# EAGLE schematic greenscreamer (EAGLE 8.5.1)
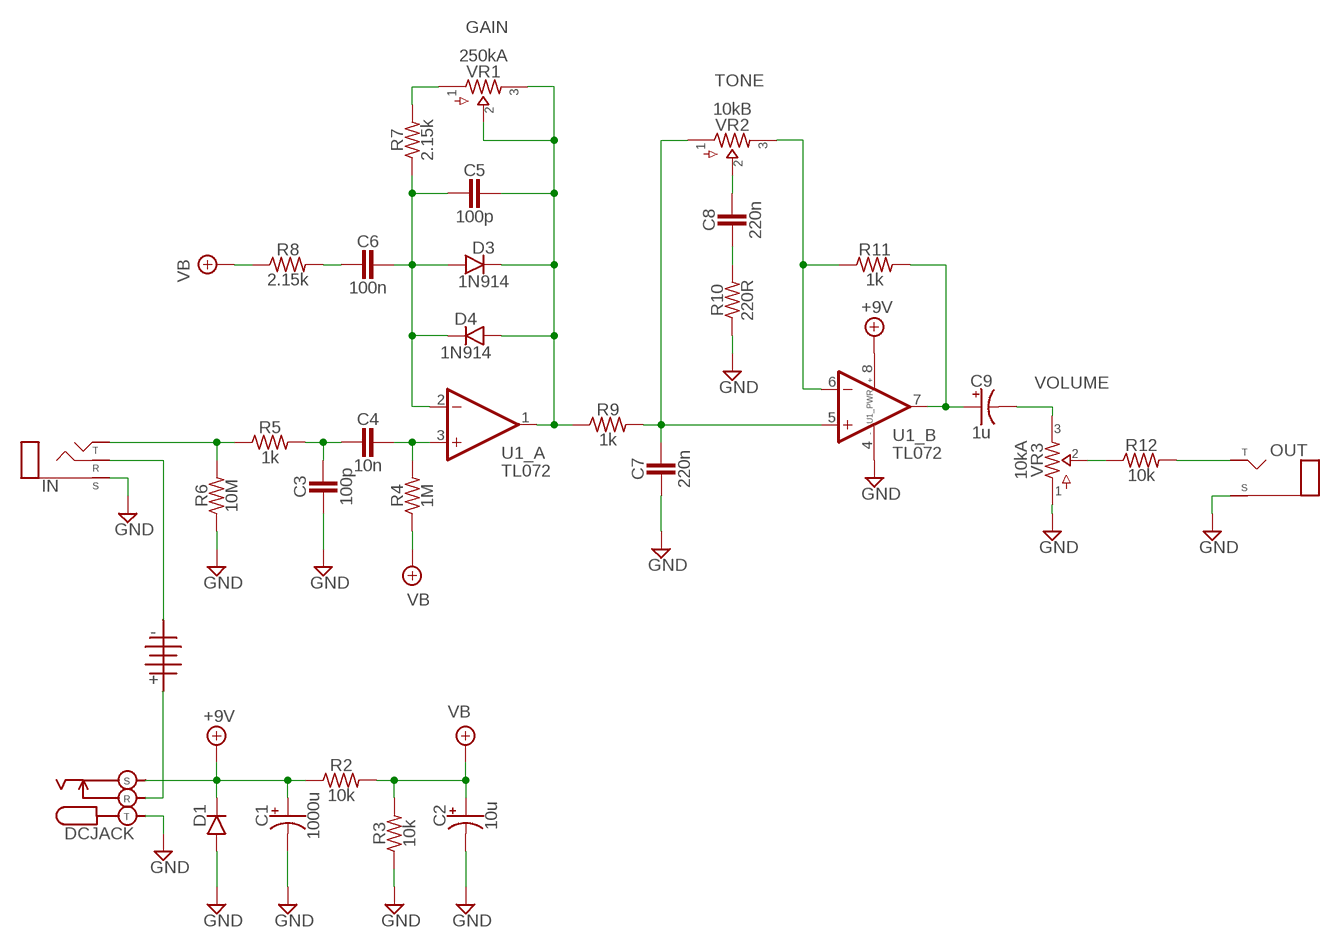
[diagram p0: schematic, sheet 1]

## Parts
1101  BATTERY  [TWO_PADS]
C1  1000u  0500  [050_020]
C2  10u  0500  [050_020]
C3  100p  CER/FILMBOX.1  [BOX_SMALL]
C4  10n  CER/FILMBOX.1  [BOX_SMALL]
C5  100p  CER/FILMBOX.1  [BOX_SMALL]
C6  100n  CER/FILMBOX.1  [BOX_SMALL]
C7  220n  CER/FILMBOX.1  [BOX_SMALL]
C8  220n  CER/FILMBOX.1  [BOX_SMALL]
C9  1u  0500  [050_020]
D1  DO35.2  [DO35-2]
D3  1N914  DO35.2  [DO35-2]
D4  1N914  DO35.2  [DO35-2]
DCJACK  DCJACK  DC_KOBICONN  [DC_KOBICONN]
IN  STEREO3PADS  [THREEPADS]
OUT  MONO  [TWO_PADS]
R2  10k  R_.3B  [R0207/3]
R3  10k  R_.3B  [R0207/3]
R4  1M  R_.3B  [R0207/3]
R5  1k  R_.3B  [R0207/3]
R6  10M  R_.3B  [R0207/3]
R7  2.15k  R_.3B  [R0207/3]
R8  2.15k  R_.3B  [R0207/3]
R9  1k  R_.3B  [R0207/3]
R10  220R  R_.3B  [R0207/3]
R11  1k  R_.3B  [R0207/3]
R12  10k  R_.3B  [R0207/3]
U1  TL072  DUALTH  [DIL0]
VR1  250kA  POTS16MM  [16MM]
VR2  10kB  POTS16MM  [16MM]
VR3  10kA  POTS16MM  [16MM]

## Nets
+9V: C1.+ D1.C DCJACK.S R2.1 U1.8(_PWR:V+)
GND: C1.- C2.- C3.2 C7.2 D1.A DCJACK.T IN.SLEEVE(S) OUT.S(SLEEVE) R3.1 R6.1 R10.1 U1.4(_PWR:V-) VR3.1
N$1: IN.TIP(T) R5.1 R6.2
N$2: 1101.S IN.RING(R)
N$3: C3.1 C4.2 R5.2
N$4: C9.- VR3.3
N$5: C4.1 R4.2 U1.3(_A:+IN)
N$6: C5.2 C6.1 D3.A D4.C R7.1 U1.2(_A:-IN)
N$7: R7.2 VR1.1
N$8: C5.1 D3.C D4.A R9.1 U1.1(_A:OUT) VR1.2 VR1.3
N$9: C6.2 R8.2
N$10: C7.1 R9.2 U1.5(_B:+IN) VR2.1
N$11: R11.1 U1.6(_B:-IN) VR2.3
N$12: C9.+ R11.2 U1.7(_B:OUT)
N$14: C8.1 VR2.2
N$15: C8.2 R10.2
N$16: R12.1 VR3.2
N$17: OUT.T(TIP) R12.2
N$28: 1101.T DCJACK.R
VB: C2.+ R2.2 R3.2 R4.1 R8.1

## Notes on the sheet
- GAIN
- TONE
- VOLUME

## Library data of the parts
1101 = pedals-jacks:BATTERY
C1 C2 C9 = pedals-capacitors-elec:050
C3-C8 = pedals-capacitors-film:CER/FILM: 47 - 120pF Xicon Ceramic Disc 2.5mm lead spacing
D1 D3 D4 = pedals-diodes:DO35: DO-35 Package Diodes: 1N914
DCJACK = pedals-jacks:DC_KOBICONN
IN = pedals-jacks:STEREO
OUT = pedals-jacks:MONO: Mono 1/4" Phone Jack
R2-R12 = pedals-resistors:R_
U1 = pedals-integrated circuits:DUAL: OP AMP
VR1-VR3 = pedals-potentiometers:POTS